# Altium schematic sheet EEG-Electrodes.SchDoc
size A4; Organization: Memristor-Robotics; Address1: Vladimira Perića Valtera; Address2: Novi Sad, 21000; Address3: Serbia; SheetNumber: 5; SheetTotal: 5
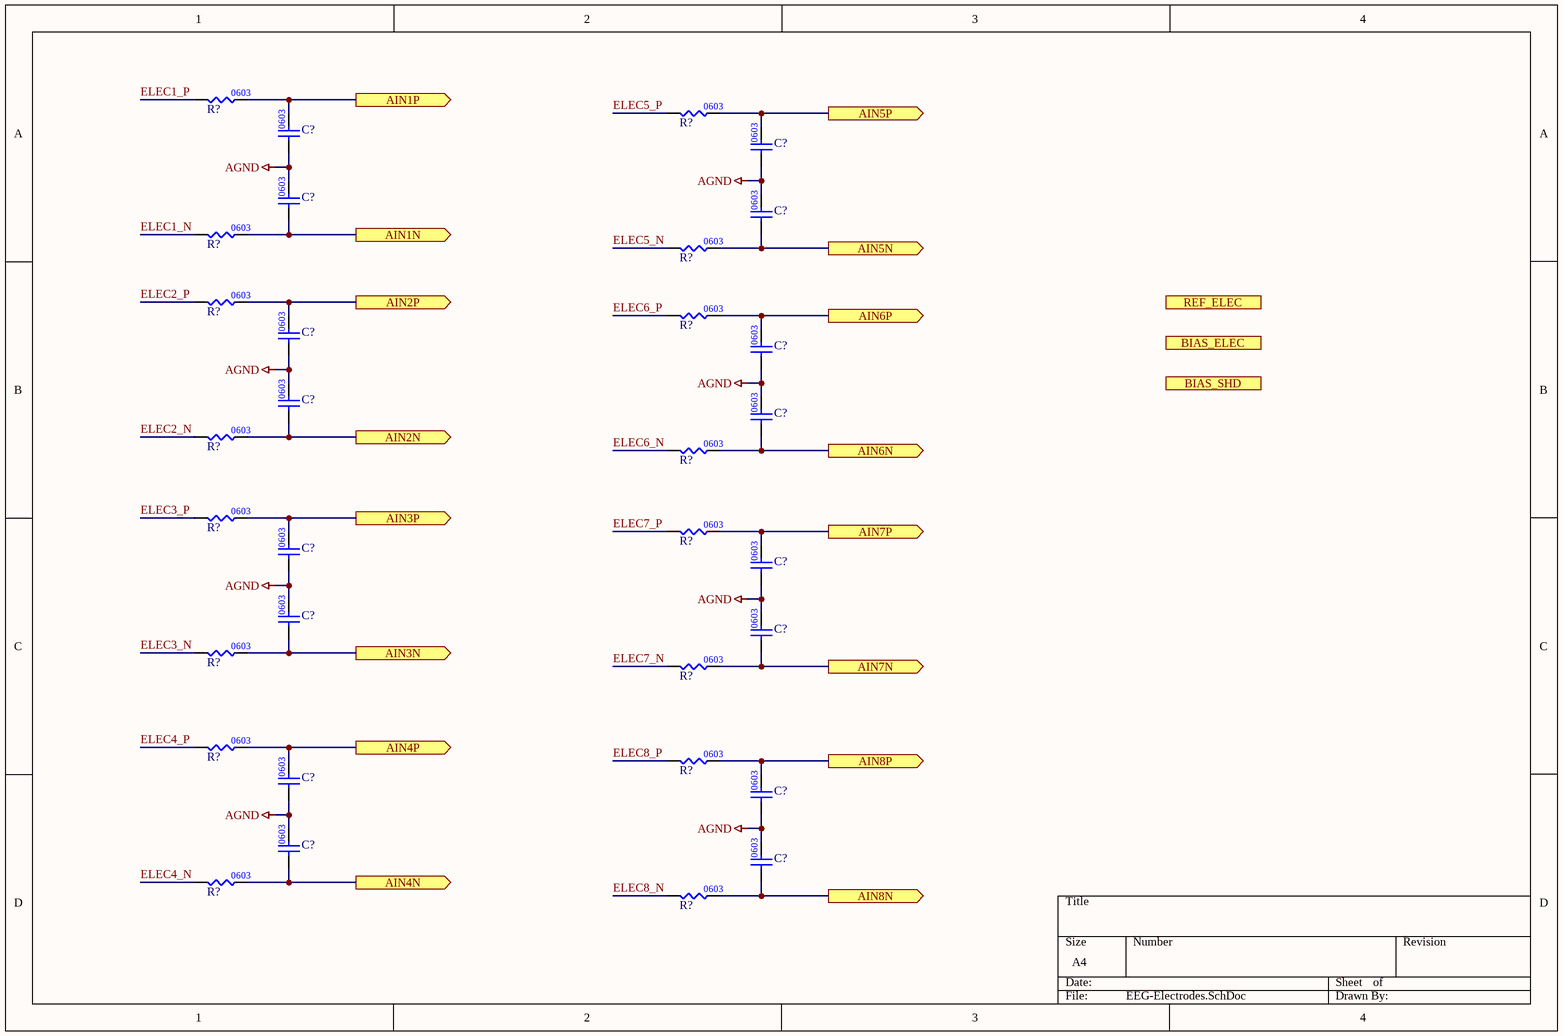
[diagram p0: EEG-Electrodes.SchDoc]

## Parts
(Parts that share a designator on the sheet are numbered #1, #2 ... from top to bottom, then left to right.)
C?#1  CAP_0603  [CAP0603]  (value not drawn)
C?#2  CAP_0603  [CAP0603]  (value not drawn)
C?#3  CAP_0603  [CAP0603]  (value not drawn)
C?#4  CAP_0603  [CAP0603]  (value not drawn)
C?#5  CAP_0603  [CAP0603]  (value not drawn)
C?#6  CAP_0603  [CAP0603]  (value not drawn)
C?#7  CAP_0603  [CAP0603]  (value not drawn)
C?#8  CAP_0603  [CAP0603]  (value not drawn)
C?#9  CAP_0603  [CAP0603]  (value not drawn)
C?#10  CAP_0603  [CAP0603]  (value not drawn)
C?#11  CAP_0603  [CAP0603]  (value not drawn)
C?#12  CAP_0603  [CAP0603]  (value not drawn)
C?#13  CAP_0603  [CAP0603]  (value not drawn)
C?#14  CAP_0603  [CAP0603]  (value not drawn)
C?#15  CAP_0603  [CAP0603]  (value not drawn)
C?#16  CAP_0603  [CAP0603]  (value not drawn)
R?#1  RES_0603  [RES0603]  (value not drawn)
R?#2  RES_0603  [RES0603]  (value not drawn)
R?#3  RES_0603  [RES0603]  (value not drawn)
R?#4  RES_0603  [RES0603]  (value not drawn)
R?#5  RES_0603  [RES0603]  (value not drawn)
R?#6  RES_0603  [RES0603]  (value not drawn)
R?#7  RES_0603  [RES0603]  (value not drawn)
R?#8  RES_0603  [RES0603]  (value not drawn)
R?#9  RES_0603  [RES0603]  (value not drawn)
R?#10  RES_0603  [RES0603]  (value not drawn)
R?#11  RES_0603  [RES0603]  (value not drawn)
R?#12  RES_0603  [RES0603]  (value not drawn)
R?#13  RES_0603  [RES0603]  (value not drawn)
R?#14  RES_0603  [RES0603]  (value not drawn)
R?#15  RES_0603  [RES0603]  (value not drawn)
R?#16  RES_0603  [RES0603]  (value not drawn)

## Ports
AIN1N (out), AIN1P (out), AIN2N (out), AIN2P (out), AIN3N (out), AIN3P (out), AIN4N (out), AIN4P (out), AIN5N (out), AIN5P (out), AIN6N (out), AIN6P (out), AIN7N (out), AIN7P (out), AIN8N (out), AIN8P (out), BIAS_ELEC (in), BIAS_SHD (in), REF_ELEC (out)

## Nets
AGND: C?#1.1 C?#2.1 C?#3.2 C?#4.2 C?#5.1 C?#6.1 C?#7.2 C?#8.2 C?#9.1 C?#10.1 C?#11.2 C?#12.2 C?#13.1 C?#14.1 C?#15.2 C?#16.2
AIN1N: C?#3.1 R?#3.2 ; port AIN1N
AIN1P: C?#1.2 R?#1.2 ; port AIN1P
AIN2N: C?#7.1 R?#7.2 ; port AIN2N
AIN2P: C?#5.2 R?#5.2 ; port AIN2P
AIN3N: C?#11.1 R?#11.2 ; port AIN3N
AIN3P: C?#9.2 R?#9.2 ; port AIN3P
AIN4N: C?#15.1 R?#15.2 ; port AIN4N
AIN4P: C?#13.2 R?#13.2 ; port AIN4P
AIN5N: C?#4.1 R?#4.2 ; port AIN5N
AIN5P: C?#2.2 R?#2.2 ; port AIN5P
AIN6N: C?#8.1 R?#8.2 ; port AIN6N
AIN6P: C?#6.2 R?#6.2 ; port AIN6P
AIN7N: C?#12.1 R?#12.2 ; port AIN7N
AIN7P: C?#10.2 R?#10.2 ; port AIN7P
AIN8N: C?#16.1 R?#16.2 ; port AIN8N
AIN8P: C?#14.2 R?#14.2 ; port AIN8P
ELEC1_N: R?#3.1
ELEC1_P: R?#1.1
ELEC2_N: R?#7.1
ELEC2_P: R?#5.1
ELEC3_N: R?#11.1
ELEC3_P: R?#9.1
ELEC4_N: R?#15.1
ELEC4_P: R?#13.1
ELEC5_N: R?#4.1
ELEC5_P: R?#2.1
ELEC6_N: R?#8.1
ELEC6_P: R?#6.1
ELEC7_N: R?#12.1
ELEC7_P: R?#10.1
ELEC8_N: R?#16.1
ELEC8_P: R?#14.1

## Notes on the sheet
- Title
- Date:
- Design Engineer:
- Time:
- Revision:
- Sheet
- of
- Size:
- A4
- www.memristor-robotics.io
- File:
- (in symbol RES_0603) 0603

## Library data of the parts
C?#1-C?#16 = CAP_0603: Generic 0603 cap; Manufacturer 1: *; Manufacturer Part Number 1: *; Supplier 1: *; Supplier Part Number 1: *; Value: *; Voltage Rating: *; Package: 0603; Mounting Type: Surface Mount
R?#1-R?#16 = RES_0603: Generic 0603 resistor